# EasyEDA Pro project 第十届农装PCB工程.epro, schematic Schematic2
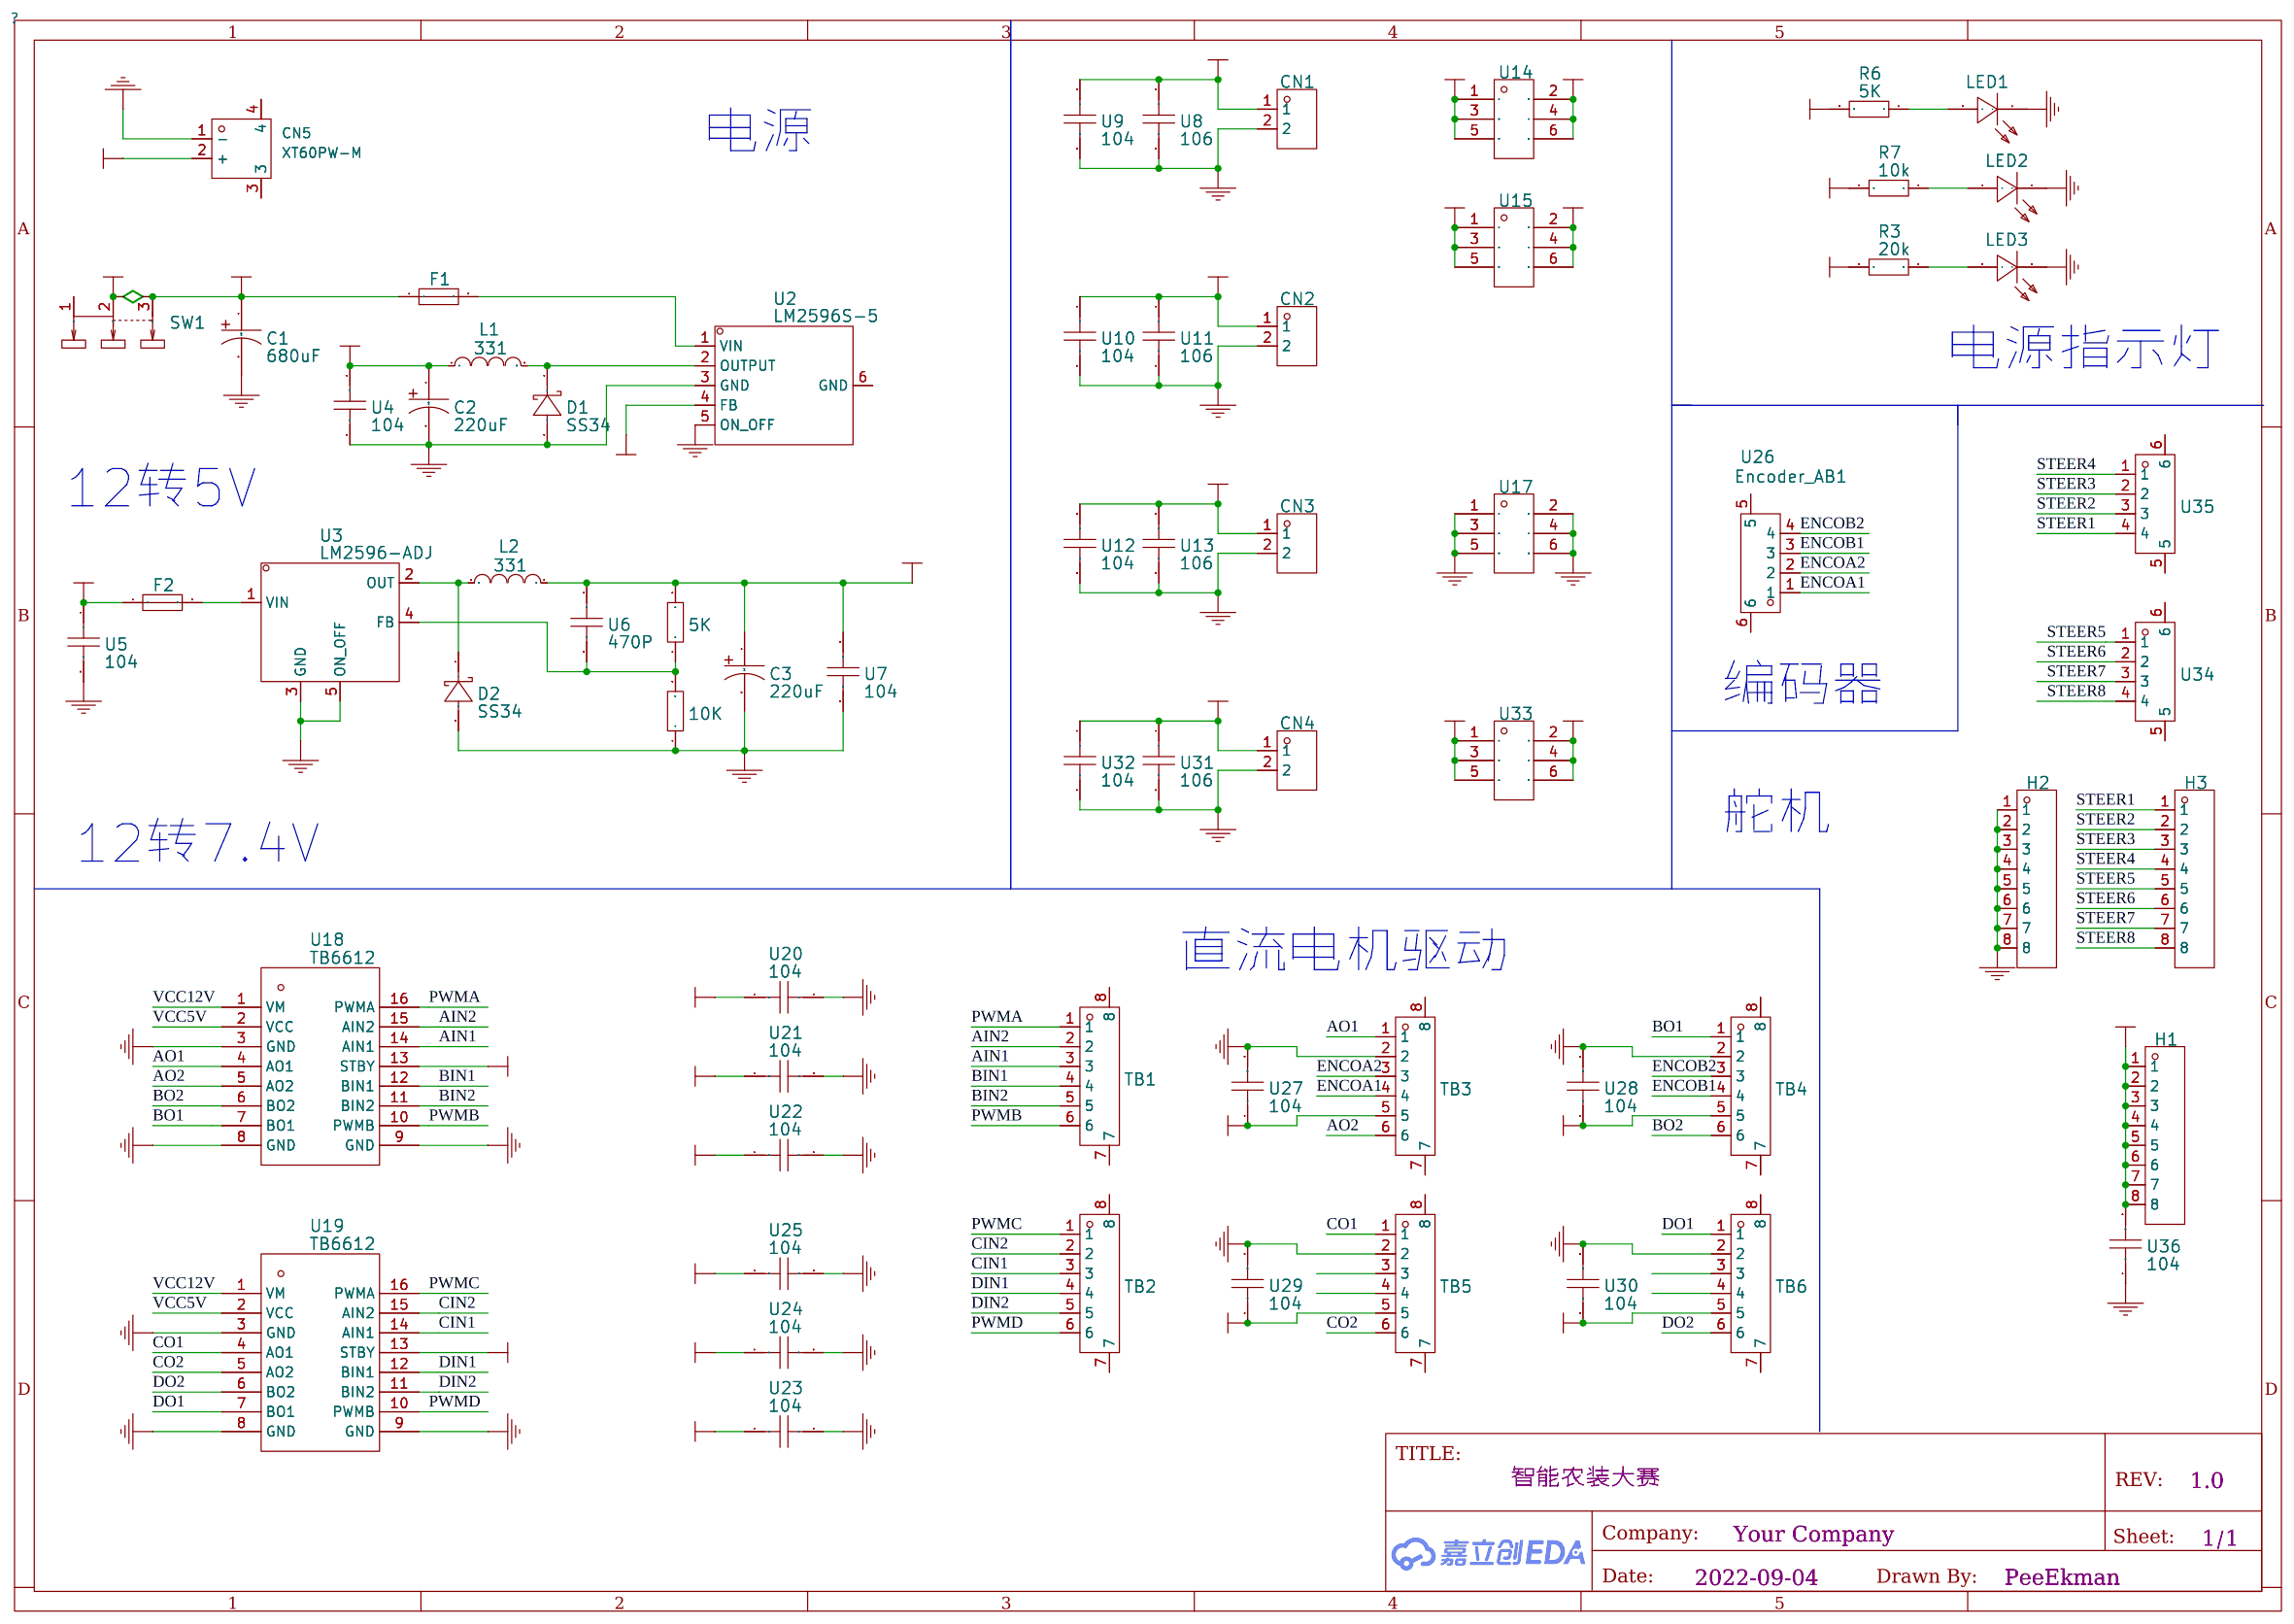
[diagram p2: schematic sheet]

## Parts
5K  TR0805D220KP0550Z
10K  TR0805D220KP0550Z
C1  680uF
C2  220uF
C3  220uF
CN1  XY2500R-F-3.81-2P
CN2  XY2500R-F-3.81-2P
CN3  XY2500R-F-3.81-2P
CN4  XY2500R-F-3.81-2P
CN5  XT60PW-M  [CONN-TH_XT60PW-M]
D1  SS34
D2  SS34
F1  FSMD012-1206-R
F2  FSMD012-1206-R
H1  B2100R08PA001
H2  B2100R08PA001
H3  B2100R08PA001
L1  331
L2  331
LED1  FC-2012HRK-620D
LED2  FC-2012HRK-620D
LED3  FC-2012HRK-620D
R3  20k
R6  5K
R7  10k
SW1  SS-12D10L5
TB1  2.54-6PWT
TB2  2.54-6PWT
TB3  2.54-6PWT
TB4  2.54-6PWT
TB5  2.54-6PWT
TB6  2.54-6PWT
U2  LM2596S-5
U3  LM2596-ADJ
U4  104
U5  104
U6  470P
U7  104
U8  106
U9  104
U10  104
U11  106
U12  104
U13  106
U14  A1-6PA-2.5DSA(71)
U15  A1-6PA-2.5DSA(71)
U17  A1-6PA-2.5DSA(71)
U18  TB6612
U19  TB6612
U20  104
U21  104
U22  104
U23  104
U24  104
U25  104
U26  Encoder_AB1
U27  104
U28  104
U29  104
U30  104
U31  106
U32  104
U33  A1-6PA-2.5DSA(71)
U34  Encoder_AB1
U35  Encoder_AB1
U36  104

## Library data of the parts
5K 10K R3 R6 R7 = TR0805D220KP0550Z: Supplier: LCSC; Supplier Part: C2858412; Manufacturer: null; JLCPCB Part Class: ExtendedPart
C1-C3 = NFA450VB6.8M10*16_5.0TP: Supplier: LCSC; Supplier Part: C347008; Manufacturer: SamYoungElectronics; JLCPCB Part Class: ExtendedPart
CN1-CN4 = XY2500R-F-3.81-2P: Supplier: LCSC; Supplier Part: C880581; Manufacturer: NingboXinlaiyaElec.; JLCPCB Part Class: ExtendedPart
CN5 = XT60PW-M: 类别:-;类型1:-;; LCSC Part Name: AMASS(艾迈斯)航模插头xt60连接器150公母对接pw锂电池公头 板插卧式XT60PW-M; Supplier Part: C98732; Manufacturer: AMASS(艾迈斯); JLCPCB Part Class: Extended Part; Datasheet: https://atta.szlcsc.com/upload/public/pdf/source/20240118/44A3DCFF53BE25DC65378AFFB21277A4.pdf; Supplier: LCSC; Brand: 艾迈斯; Type: 卧式插头; Colour: 黄色; InterfaceType: 公头
D1 D2 = SS34: Supplier: LCSC; Supplier Part: C3032484; Manufacturer: TDD(台冠电子)
F1 F2 = FSMD012-1206-R: Supplier: LCSC; Supplier Part: C220144; Manufacturer: FuzetecTech; JLCPCB Part Class: ExtendedPart
H1-H3 = B2100R08PA001: Supplier: LCSC; Supplier Part: C379810; Manufacturer: ShenzhenCankemeng; JLCPCB Part Class: ExtendedPart
L1 L2 = CDRH74-220MT: Supplier: LCSC; Supplier Part: C133406; Manufacturer: MeledIndustrial; JLCPCB Part Class: ExtendedPart
LED1-LED3 = FC-2012HRK-620D: Supplier: LCSC; Manufacturer: NATIONSTAR; Supplier Part: C84256; JLCPCB Part Class: BasicPart
SW1 = SS-12D10L5: Supplier: LCSC; Supplier Part: C319012; Manufacturer: XKBEnterprise; JLCPCB Part Class: ExtendedPart
TB1-TB6 = 2.54-6PWT: Supplier: LCSC; Supplier Part: C3008583; Manufacturer: SHOUHAN(首韩); link: https://atta.szlcsc.com/upload/public/pdf/source/20220427/ADCB6F8DE9D3C06EE34CC237BEA1B974.pdf; JLCPCB Part Class: ExtendedPart
U2 = LM2596S-ADJ: Supplier: LCSC; Supplier Part: C2980822; Manufacturer: Slkor(萨科微); link: https://atta.szlcsc.com/upload/public/pdf/source/20220307/C046D05446129399B25291728EA96E14.pdf; JLCPCB Part Class: ExtendedPart
U3 = LM2596-ADJ
U4-U13 U20-U25 U27-U32 U36 = C0805X100J5GAC7800: Supplier: LCSC; Supplier Part: C9900011191; Manufacturer: null; JLCPCB Part Class: ExtendedPart
U14 U15 U17 U33 = A1-6PA-2.5DSA(71): Supplier: LCSC; Supplier Part: C324991; Manufacturer: Hirose; JLCPCB Part Class: ExtendedPart
U18 U19 = TB6612
U26 U34 U35 = 2.54-4PWT: Supplier: LCSC; Supplier Part: C3008582; Manufacturer: SHOUHAN(首韩); link: https://atta.szlcsc.com/upload/public/pdf/source/20220427/2E7F20871E2A02EADA0277D3DA8C9F6A.pdf; JLCPCB Part Class: ExtendedPart

## Nets
GND: 10K.1 C1.2 C2.2 C3.2 CN1.2 CN2.2 CN3.2 CN4.2 CN5.1(-) D1.2(A) D2.2(A) H2.1 H2.2 H2.3 H2.4 H2.5 H2.6 H2.7 H2.8 LED1.1(-) LED2.1(-) LED3.1(-) TB3.2 TB4.2 TB5.2 TB6.2 U2.3(GND) U2.5(ON_OFF) U3.3(GND) U3.5(ON_OFF) U4.2 U5.2 U7.2 U8.2 U9.2 U10.2 U11.2 U12.2 U13.2 U17.1 U17.2 U17.3 U17.4 U17.5 U17.6 U18.3(GND) U18.8(GND) U18.9(GND) U19.3(GND) U19.8(GND) U19.9(GND) U20.2 U21.2 U22.2 U23.2 U24.2 U25.2 U27.2 U28.2 U29.2 U30.2 U31.2 U32.2 U36.1
VCC5V: C2.1 CN2.1 CN3.1 L1.1 R6.2 TB3.5 TB4.5 TB5.5 TB6.5 U2.4(FB) U4.1 U10.1 U11.1 U12.1 U13.1 U15.1 U15.2 U15.3 U15.4 U15.5 U15.6 U18.2(VCC) U18.13(STBY) U19.2(VCC) U19.13(STBY) U21.1 U22.1 U23.1 U24.1 U27.1 U28.1 U29.1 U30.1
VCC7.4V: 5K.2 C3.1 CN4.1 H1.1 H1.2 H1.3 H1.4 H1.5 H1.6 H1.7 H1.8 L2.2 R7.2 U6.1 U7.1 U31.1 U32.1 U33.1 U33.2 U33.3 U33.4 U33.5 U33.6 U36.2
AIN1: TB1.3 U18.14(AIN1)
AIN2: TB1.2 U18.15(AIN2)
AO1: TB3.1 U18.4(AO1)
AO2: TB3.6 U18.5(AO2)
BIN1: TB1.4 U18.12(BIN1)
BIN2: TB1.5 U18.11(BIN2)
BO1: TB4.1 U18.7(BO1)
BO2: TB4.6 U18.6(BO2)
CIN1: TB2.3 U19.14(AIN1)
CIN2: TB2.2 U19.15(AIN2)
CO1: TB5.1 U19.4(AO1)
CO2: TB5.6 U19.5(AO2)
DIN1: TB2.4 U19.12(BIN1)
DIN2: TB2.5 U19.11(BIN2)
DO1: TB6.1 U19.7(BO1)
DO2: TB6.6 U19.6(BO2)
ENCOA1: TB3.4 U26.1
ENCOA2: TB3.3 U26.2
ENCOB1: TB4.4 U26.3
ENCOB2: TB4.3 U26.4
POWER12V: C1.1 CN1.1 CN5.2(+) F1.1 F2.1 R3.2 SW1.2 SW1.3 U5.1 U8.1 U9.1 U14.1 U14.2 U14.3 U14.4 U14.5 U14.6 U18.1(VM) U19.1(VM) U20.1 U25.1
PWMA: TB1.1 U18.16(PWMA)
PWMB: TB1.6 U18.10(PWMB)
PWMC: TB2.1 U19.16(PWMA)
PWMD: TB2.6 U19.10(PWMB)
STEER1: H3.1 U35.4
STEER2: H3.2 U35.3
STEER3: H3.3 U35.2
STEER4: H3.4 U35.1
STEER5: H3.5 U34.1
STEER6: H3.6 U34.2
STEER7: H3.7 U34.3
STEER8: H3.8 U34.4
LED3_2: LED3.2(+) R3.1
Net-(5K-1): 5K.1 10K.2 U3.4(FB) U6.2
Net-(D1-1): D1.1(K) L1.2 U2.2(OUTPUT)
Net-(D2-1): D2.1(K) L2.1 U3.2(OUT)
Net-(F1-2): F1.2 U2.1(VIN)
Net-(F2-2): F2.2 U3.1(VIN)
R6_1: LED1.2(+) R6.1
R7_1: LED2.2(+) R7.1

Not connected (* = marked no-connect by the designer): CN5 3 4; SW1 1; TB1 7 8; TB2 7 8; TB3 7 8; TB4 7 8; TB5 3 4 7 8; TB6 3 4 7 8; U2 6(GND); U26 5 6; U34 5 6; U35 5 6

## Notes on the sheet
- 电源
- 电源指示灯
- 12转5V
- 编码器
- 舵机
- 12转7.4V
- 直流电机驱动
